# Altium schematic sheet portsAndMemory.SchDoc
size A4
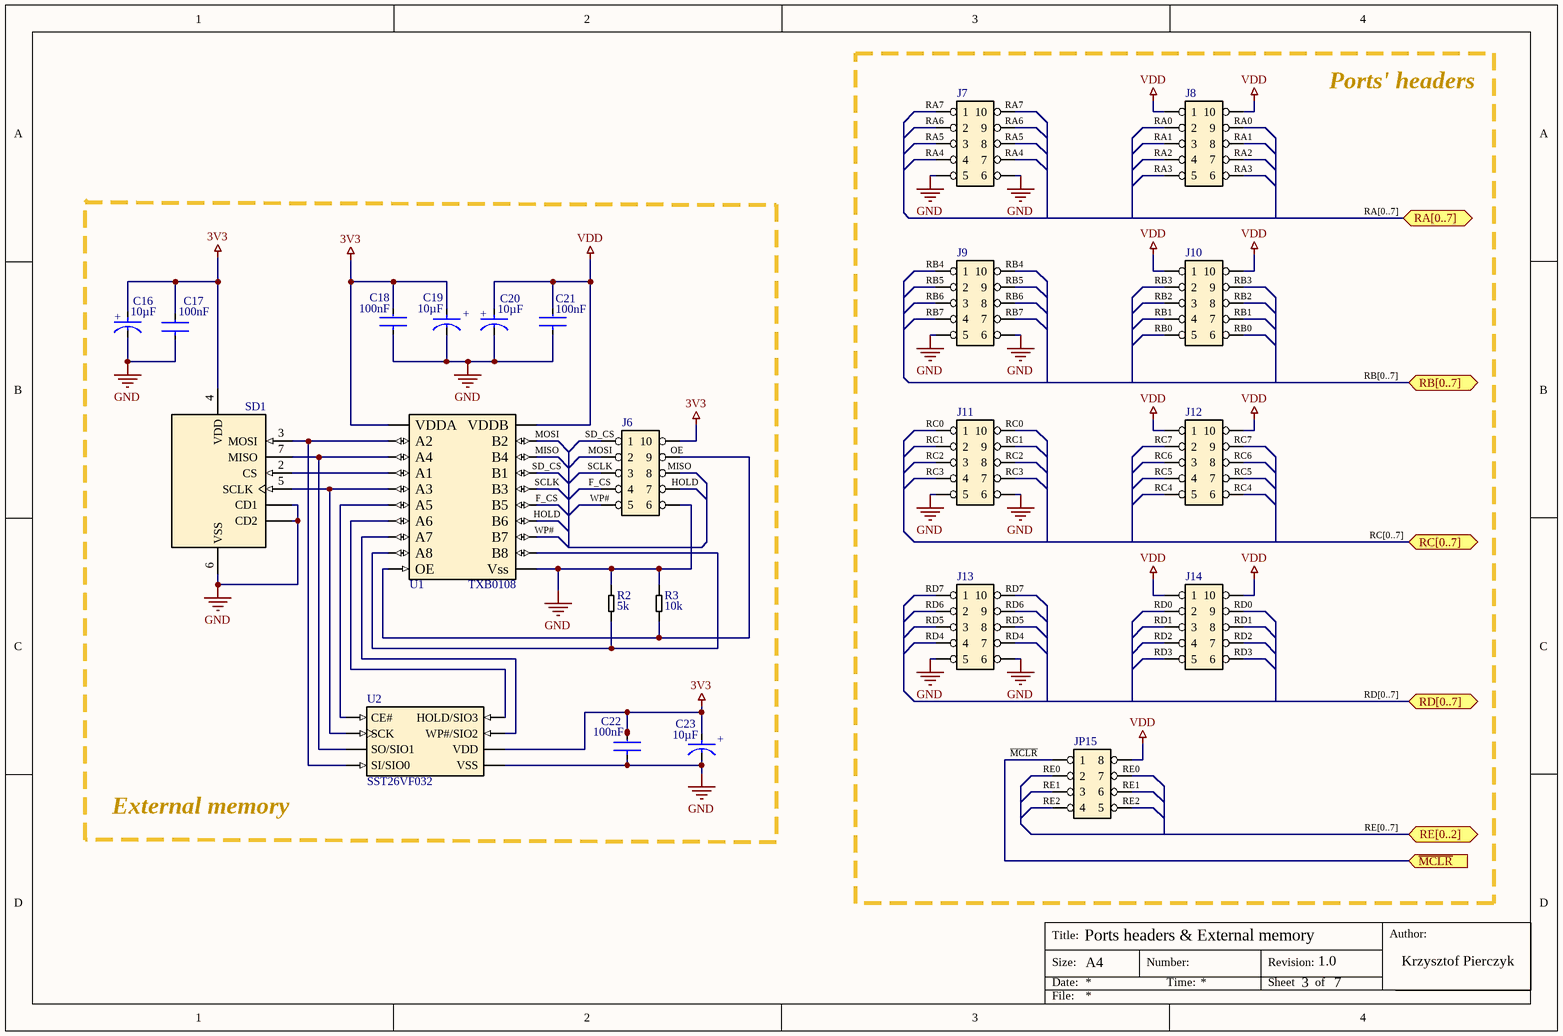
[diagram p0: portsAndMemory.SchDoc]

## Parts
C16  Capacitance: 10µF  [FP-F98S-MFG]  (hidden comment: F981C106MSAAS1)
C17  value 100nF  [FP-C0805C-DN-MFG]  (hidden comment: C0805C102J5GACTU)
C18  value 100nF  [FP-C0805C-DN-MFG]  (hidden comment: C0805C102J5GACTU)
C19  Capacitance: 10µF  [FP-F98S-MFG]  (hidden comment: F981C106MSAAS1)
C20  Capacitance: 10µF  [FP-F98S-MFG]  (hidden comment: F981C106MSAAS1)
C21  value 100nF  [FP-C0805C-DN-MFG]  (hidden comment: C0805C102J5GACTU)
C22  value 100nF  [FP-C0805C-DN-MFG]  (hidden comment: C0805C102J5GACTU)
C23  Capacitance: 10µF  [FP-F98S-MFG]  (hidden comment: F981C106MSAAS1)
J6  Header 2x5  [Header2x5]  (value not drawn)
J7  Header 2x5  [Header2x5]  (value not drawn)
J8  Header 2x5  [Header2x5]  (value not drawn)
J9  Header 2x5  [Header2x5]  (value not drawn)
J10  Header 2x5  [Header2x5]  (value not drawn)
J11  Header 2x5  [Header2x5]  (value not drawn)
J12  Header 2x5  [Header2x5]  (value not drawn)
J13  Header 2x5  [Header2x5]  (value not drawn)
J14  Header 2x5  [Header2x5]  (value not drawn)
JP15  Header 2x4  [Header 2x4]  (value not drawn)
R2  Resistance: 5k  [0805]  (hidden comment: Resistor)
R3  Resistance: 10k  [0805]  (hidden comment: Resistor)
SD1  AMPHENOL114-00841-68 (uSD)  [114-00841-68 (AMPHENOL)]  (value not drawn)
U1  TXB0108  [TSSOP-20]
U2  SST26VF032  [SOIJ-8]

## Blocks framed on the sheet
Ports' headers: J7-J14 JP15

## Ports
RA[0..7] (bidir), RB[0..7] (bidir), RC[0..7] (bidir), RD[0..7] (bidir), RE[0..2] (bidir), ~{MCLR} (in)

## Nets
3V3: C16.2(A) C17.2 C18.2 C19.2(A) C22.2 C23.2(A) J6.10 SD1.4(VDD) U1.5(VDDA) U2.8(VDD)
GND: C16.1(C) C17.1 C18.1 C19.1(C) C20.1(C) C21.1 C22.1 C23.1(C) J6.6 J7.5 J7.6 J9.5 J9.6 J11.5 J11.6 J13.5 J13.6 R2.1 R3.1 SD1.6(VSS) SD1.CD1 SD1.CD2 U1.15(Vss) U2.4(VSS)
VDD: C20.2(A) C21.2 J8.1 J8.10 J10.1 J10.10 J12.1 J12.10 J14.1 J14.10 JP15.8 U1.16(VDDB)
F_CS: J6.4 U1.14(B5)
HOLD: J6.7 U1.13(B6)
~{MCLR}: JP15.1 ; port ~{MCLR}
MISO: J6.8 U1.17(B4)
MOSI: J6.2 U1.19(B2)
RA0: J8.2 J8.9
RA1: J8.3 J8.8
RA2: J8.4 J8.7
RA3: J8.5 J8.6
RA4: J7.4 J7.7
RA5: J7.3 J7.8
RA6: J7.2 J7.9
RA7: J7.1 J7.10
RB0: J10.5 J10.6
RB1: J10.4 J10.7
RB2: J10.3 J10.8
RB3: J10.2 J10.9
RB4: J9.1 J9.10
RB5: J9.2 J9.9
RB6: J9.3 J9.8
RB7: J9.4 J9.7
RC0: J11.1 J11.10
RC1: J11.2 J11.9
RC2: J11.3 J11.8
RC3: J11.4 J11.7
RC4: J12.5 J12.6
RC5: J12.4 J12.7
RC6: J12.3 J12.8
RC7: J12.2 J12.9
RD0: J14.2 J14.9
RD1: J14.3 J14.8
RD2: J14.4 J14.7
RD3: J14.5 J14.6
RD4: J13.4 J13.7
RD5: J13.3 J13.8
RD6: J13.2 J13.9
RD7: J13.1 J13.10
RE0: JP15.2 JP15.7
RE1: JP15.3 JP15.6
RE2: JP15.4 JP15.5
SCLK: J6.3 U1.18(B3)
SD_CS: J6.1 U1.20(B1)
WP#: J6.5 U1.12(B7)
NetJ6_9: J6.9 R3.2 U1.6(OE)
NetR2_2: R2.2 U1.10(A8) U1.11(B8)
NetSD1_2: SD1.2(CS) U1.1(A1)
NetSD1_3: SD1.3(MOSI) U1.2(A2) U2.5(SI/SIO0)
NetSD1_5: SD1.5(SCLK) U1.3(A3) U2.6(SCK)
NetSD1_7: SD1.7(MISO) U1.4(A4) U2.2(SO/SIO1)
NetU1_7: U1.7(A5) U2.1(CE#)
NetU1_8: U1.8(A6) U2.7(HOLD/SIO3)
NetU1_9: U1.9(A7) U2.3(WP#/SIO2)

## Buses and harness runs
bus RA[0..7] = port RA[0..7]
bus RB[0..7] = port RB[0..7]
bus RC[0..7] = port RC[0..7]
bus RD[0..7] = port RD[0..7]
bus RE[0..7] = port RE[0..2]

## Notes on the sheet
- External memory
- Ports headers & External memory
- 3
- 1.0
- 7
- Labels drawn without touching a wire or pin: OE
- Title:
- Size:
- Date:
- A4
- Number:
- Time:
- Revision:
- Sheet
- of
- Author:
- Krzysztof Pierczyk
- File:
- (in symbol CMP-04424-000018-1) +

## Library data of the parts
C16 C19 C20 C23 = CMP-04424-000018-1: CAP TANT 10UF 20% 16V 0805; Manufacturer: AVX; Esr: 4.5Ω; Material: Tantalum; Ripple Current: 100mA; Leakage Current: 1.6uA; Life: 1000Hours; Dissipation Factor: 18%; Temperature Range High: +125°C; Temperature: -55°C to +125°C; Digikey Description: CAP TANT 10UF 20% 16V 0805; Tolerance: 20%; Automotive: No; Voltage Rating: 16V; Device Class L3: Tantalum Capacitors; Package: F98S; Device Class L2: Capacitors; Footprint Url: https://www.avx.com/download/software/literature/AVX-Footprint-Library.pdf; Mouser Description: Cap Tant Solid 10uF 16V S CASE 20% (2 x 1.25 x 0.8mm) SMD 2012-09 4.5Ohm 125°C T/R; Value: 10uF; ComponentLink2URL: http://datasheets.avx.com/F98-AS1.pdf; Height: 0.9mm; Manufacturer Part Number: F981C106MSAAS1; ComponentLink2Description: Datasheet; Lead Free: Yes; Category: Cap; Temperature Coefficient: 20%; RoHS: TRUE; Temperature Range Low: -55°C; Octopart: https://octopart.com/f981c106msaas1-avx-49645945; Device Class L1: Passive Components
C17 C18 C21 C22 = CMP-03020-008364-1: CAP CER 1000PF 50V C0G/NP0 0805; Manufacturer: KEMET; Capacitance: 1,000 pF; Temperature Characteristic: C0G; Material: Ceramic; Temperature Coefficient: 30ppm/°C; Tolerance: 0.05; Automotive: No; Voltage Rating: 50 V; Device Class L1: Passive Components; Digikey Description: CAP CER 1000PF 50V C0G/NP0 0805; Lead Free: Yes; Package: C0805C-DN; RoHS: TRUE; Temperature Range High: +125°C; Height: 0.88mm; Ipc Land Pattern Name: CAPC200125X78; Category: Cap; ComponentLink2URL: https://content.kemet.com/datasheets/KEM_C1003_C0G_SMD.pdf; Device Class L2: Capacitors; ComponentLink2Description: Datasheet; Temperature: -55°C to +125°C; Octopart: https://octopart.com/c0805c102j5gactu-kemet-97757; Mouser Description: Multilayer Ceramic Capacitors MLCC - SMD/SMT 50volts 1000pF C0G 5%; Manufacturer Part Number: C0805C102J5GACTU; Device Class L3: Ceramic Capacitors; Temperature Range Low: -55°C
R2 R3 = Resistor: Nominal power: 125mW
SD1 = uSD: MP: 502570-0893; MF: Molex; Price: None; Package: None; Value: *; Availability: Unavailable; SnapEDA_Link: https://www.snapeda.com/parts/502570-0893/Molex/view-part/225170/?ref=snap
U1 = TXB0108: VDDB (max): 5.5V; VDDB (min): 1.65V; VDDA (max): 3.6V; VDDA (min): 1.2V; IDDB (max): 5uA; IDDA (max): 5uA; ComponentLink1Description: Datasheet; ComponentLink1URL: http://www.ti.com/lit/ds/symlink/txb0108.pdf?&ts=1589634685869
U2 = SST26VF032: VDD (min): 2.7V; VDD (max): 3.6; ICCr @104MHz: 20mA; ICCw: 25mA; ComponentLink1Description: Datasheet; ComponentLink1URL: http://ww1.microchip.com/downloads/en/devicedoc/25017a.pdf